# Altium schematic sheet MACH_NGUYEN_LY.SchDoc
size A4
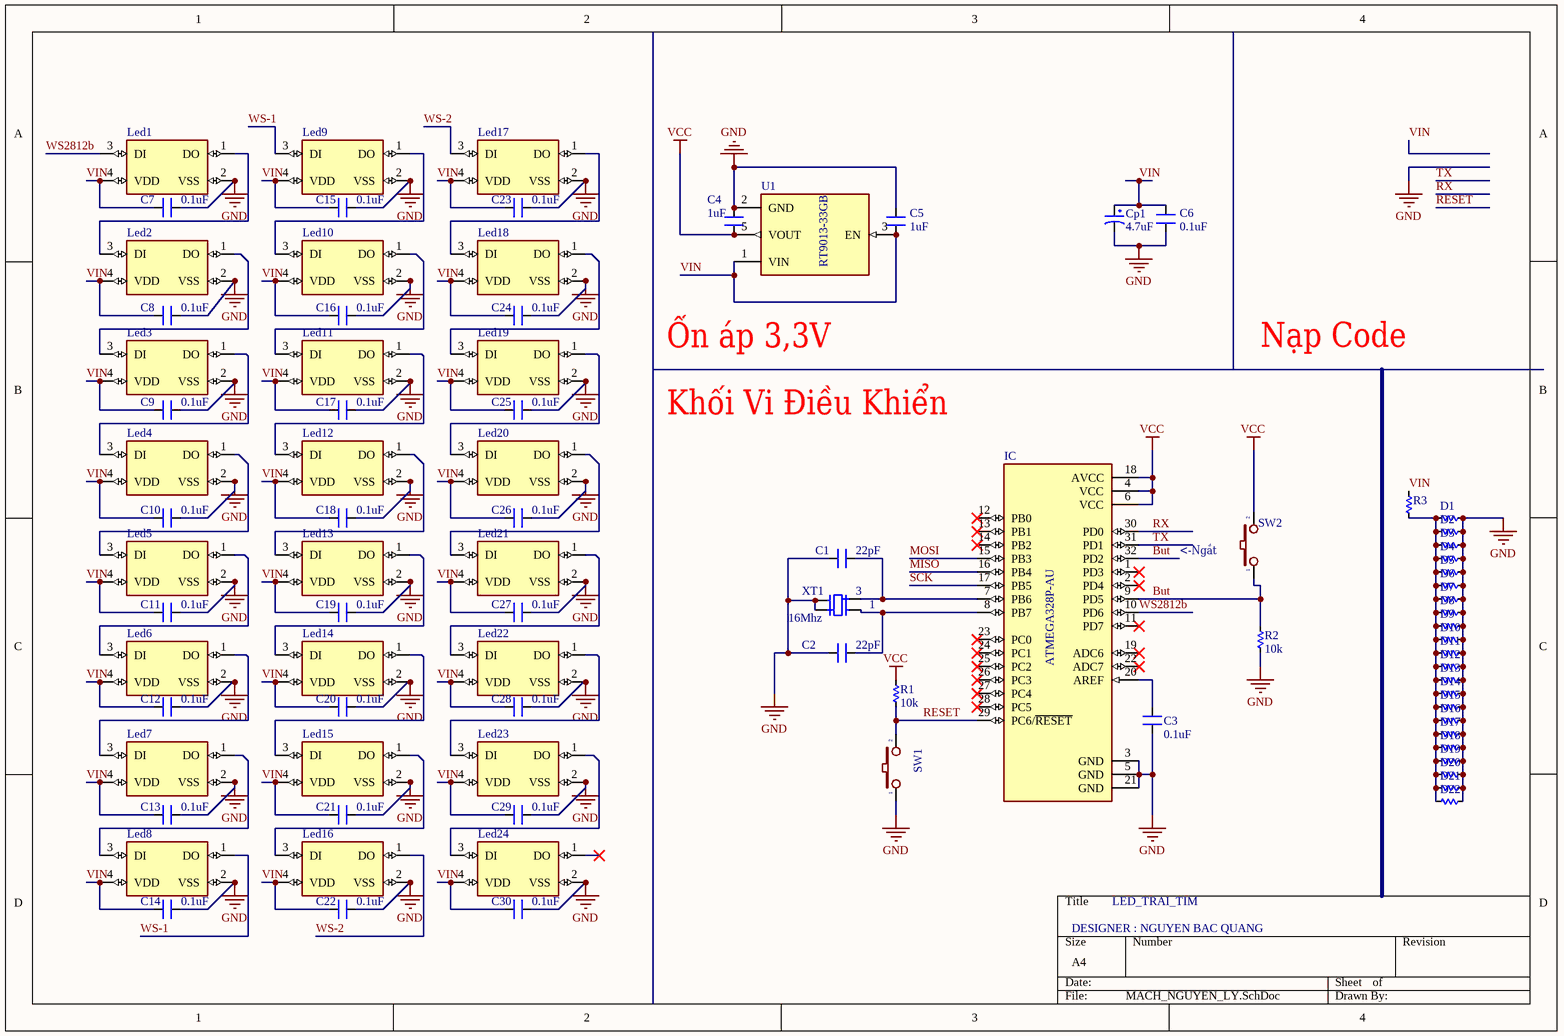
[diagram p0: MACH_NGUYEN_LY.SchDoc]

## Parts
C1  22pF  [CN-SMD-0805]
C2  22pF  [CN-SMD-0805]
C3  0.1uF  [CN-SMD-0603]
C4  1uF  [CN-SMD-0805]
C5  1uF  [CN-SMD-0805]
C6  0.1uF  [CN-SMD-0603]
C7  0.1uF  [CN-SMD-0603]
C8  0.1uF  [CN-SMD-0603]
C9  0.1uF  [CN-SMD-0603]
C10  0.1uF  [CN-SMD-0603]
C11  0.1uF  [CN-SMD-0603]
C12  0.1uF  [CN-SMD-0603]
C13  0.1uF  [CN-SMD-0603]
C14  0.1uF  [CN-SMD-0603]
C15  0.1uF  [CN-SMD-0603]
C16  0.1uF  [CN-SMD-0603]
C17  0.1uF  [CN-SMD-0603]
C18  0.1uF  [CN-SMD-0603]
C19  0.1uF  [CN-SMD-0603]
C20  0.1uF  [CN-SMD-0603]
C21  0.1uF  [CN-SMD-0603]
C22  0.1uF  [CN-SMD-0603]
C23  0.1uF  [CN-SMD-0603]
C24  0.1uF  [CN-SMD-0603]
C25  0.1uF  [CN-SMD-0603]
C26  0.1uF  [CN-SMD-0603]
C27  0.1uF  [CN-SMD-0603]
C28  0.1uF  [CN-SMD-0603]
C29  0.1uF  [CN-SMD-0603]
C30  0.1uF  [CN-SMD-0603]
Cp1  4.7uF  [tu tantalum smd3216]
D1  (no value)  [RES-SMD-0603]
D2  (no value)  [RES-SMD-0603]
D3  (no value)  [RES-SMD-0603]
D4  (no value)  [RES-SMD-0603]
D5  (no value)  [RES-SMD-0603]
D6  (no value)  [RES-SMD-0603]
D7  (no value)  [RES-SMD-0603]
D8  (no value)  [RES-SMD-0603]
D9  (no value)  [RES-SMD-0603]
D10  (no value)  [RES-SMD-0603]
D11  (no value)  [RES-SMD-0603]
D12  (no value)  [RES-SMD-0603]
D13  (no value)  [RES-SMD-0603]
D14  (no value)  [RES-SMD-0603]
D15  (no value)  [RES-SMD-0603]
D16  (no value)  [RES-SMD-0603]
D17  (no value)  [RES-SMD-0603]
D18  (no value)  [RES-SMD-0603]
D19  (no value)  [RES-SMD-0603]
D20  (no value)  [RES-SMD-0603]
D21  (no value)  [RES-SMD-0603]
D22  (no value)  [RES-SMD-0603]
IC  ATMEGA328P-AU  [QFP80P900X900X120-32N]
Led1  (no value)  [WS2812B-2020]
Led2  (no value)  [WS2812B-2020]
Led3  (no value)  [WS2812B-2020]
Led4  (no value)  [WS2812B-2020]
Led5  (no value)  [WS2812B-2020]
Led6  (no value)  [WS2812B-2020]
Led7  (no value)  [WS2812B-2020]
Led8  (no value)  [WS2812B-2020]
Led9  (no value)  [WS2812B-2020]
Led10  (no value)  [WS2812B-2020]
Led11  (no value)  [WS2812B-2020]
Led12  (no value)  [WS2812B-2020]
Led13  (no value)  [WS2812B-2020]
Led14  (no value)  [WS2812B-2020]
Led15  (no value)  [WS2812B-2020]
Led16  (no value)  [WS2812B-2020]
Led17  (no value)  [WS2812B-2020]
Led18  (no value)  [WS2812B-2020]
Led19  (no value)  [WS2812B-2020]
Led20  (no value)  [WS2812B-2020]
Led21  (no value)  [WS2812B-2020]
Led22  (no value)  [WS2812B-2020]
Led23  (no value)  [WS2812B-2020]
Led24  (no value)  [WS2812B-2020]
R1  10k  [RES-SMD-0603]
R2  10k  [RES-SMD-0603]
R3  (no value)  [RES-SMD-0603]
SW1  (no value)  [SW1-SMD]
SW2  (no value)  [SW1-SMD]
U1  RT9013-33GB  [SOT94P279X129-5N]
XT1  16Mhz  [Thach Anh 4 chan 1]

## Nets
GND: C1.1 C2.1 C3.2 C4.1 C5.2 C6.2 C7.2 C8.2 C9.2 C10.2 C11.2 C12.2 C13.2 C14.2 C15.2 C16.2 C17.2 C18.2 C19.2 C20.2 C21.2 C22.2 C23.2 C24.2 C25.2 C26.2 C27.2 C28.2 C29.2 C30.2 Cp1.2 D1.1 D2.1 D3.1 D4.1 D5.1 D6.1 D7.1 D8.1 D9.1 D10.1 D11.1 D12.1 D13.1 D14.1 D15.1 D16.1 D17.1 D18.1 D19.1 D20.1 D21.1 D22.1 IC.3(GND) IC.5(GND) IC.21(GND) Led1.2(VSS) Led2.2(VSS) Led3.2(VSS) Led4.2(VSS) Led5.2(VSS) Led6.2(VSS) Led7.2(VSS) Led8.2(VSS) Led9.2(VSS) Led10.2(VSS) Led11.2(VSS) Led12.2(VSS) Led13.2(VSS) Led14.2(VSS) Led15.2(VSS) Led16.2(VSS) Led17.2(VSS) Led18.2(VSS) Led19.2(VSS) Led20.2(VSS) Led21.2(VSS) Led22.2(VSS) Led23.2(VSS) Led24.2(VSS) R2.2 SW1.1 U1.2(GND) XT1.2 XT1.4
VCC: C4.2 IC.4(VCC) IC.6(VCC) IC.18(AVCC) R1.1 SW2.2 U1.5(VOUT)
But: IC.9(PD5) IC.32(PD2) R2.1 SW2.1
MISO: IC.16(PB4)
MOSI: IC.15(PB3)
RESET: IC.29(PC6/~{RESET}) R1.2 SW1.2
RX: IC.30(PD0)
SCK: IC.17(PB5)
TX: IC.31(PD1)
VIN: C5.1 C6.1 C7.1 C8.1 C9.1 C10.1 C11.1 C12.1 C13.1 C14.1 C15.1 C16.1 C17.1 C18.1 C19.1 C20.1 C21.1 C22.1 C23.1 C24.1 C25.1 C26.1 C27.1 C28.1 C29.1 C30.1 Cp1.1 Led1.4(VDD) Led2.4(VDD) Led3.4(VDD) Led4.4(VDD) Led5.4(VDD) Led6.4(VDD) Led7.4(VDD) Led8.4(VDD) Led9.4(VDD) Led10.4(VDD) Led11.4(VDD) Led12.4(VDD) Led13.4(VDD) Led14.4(VDD) Led15.4(VDD) Led16.4(VDD) Led17.4(VDD) Led18.4(VDD) Led19.4(VDD) Led20.4(VDD) Led21.4(VDD) Led22.4(VDD) Led23.4(VDD) Led24.4(VDD) R3.1 U1.1(VIN) U1.3(EN)
WS2812b: IC.10(PD6) Led1.3(DI)
WS-1: Led8.1(DO) Led9.3(DI)
WS-2: Led16.1(DO) Led17.3(DI)
NetC1_2: C1.2 IC.7(PB6) XT1.3
NetC2_2: C2.2 IC.8(PB7) XT1.1
NetC3_1: C3.1 IC.20(AREF)
NetD1_2: D1.2 D2.2 D3.2 D4.2 D5.2 D6.2 D7.2 D8.2 D9.2 D10.2 D11.2 D12.2 D13.2 D14.2 D15.2 D16.2 D17.2 D18.2 D19.2 D20.2 D21.2 D22.2 R3.2
NetLed1_1: Led1.1(DO) Led2.3(DI)
NetLed2_1: Led2.1(DO) Led3.3(DI)
NetLed3_1: Led3.1(DO) Led4.3(DI)
NetLed4_1: Led4.1(DO) Led5.3(DI)
NetLed5_1: Led5.1(DO) Led6.3(DI)
NetLed6_1: Led6.1(DO) Led7.3(DI)
NetLed7_1: Led7.1(DO) Led8.3(DI)
NetLed9_1: Led9.1(DO) Led10.3(DI)
NetLed10_1: Led10.1(DO) Led11.3(DI)
NetLed11_1: Led11.1(DO) Led12.3(DI)
NetLed12_1: Led12.1(DO) Led13.3(DI)
NetLed13_1: Led13.1(DO) Led14.3(DI)
NetLed14_1: Led14.1(DO) Led15.3(DI)
NetLed15_1: Led15.1(DO) Led16.3(DI)
NetLed17_1: Led17.1(DO) Led18.3(DI)
NetLed18_1: Led18.1(DO) Led19.3(DI)
NetLed19_1: Led19.1(DO) Led20.3(DI)
NetLed20_1: Led20.1(DO) Led21.3(DI)
NetLed21_1: Led21.1(DO) Led22.3(DI)
NetLed22_1: Led22.1(DO) Led23.3(DI)
NetLed23_1: Led23.1(DO) Led24.3(DI)

Not connected (* = marked no-connect by the designer): IC 1(PD3)* 2(PD4)* 11(PD7)* 12(PB0)* 13(PB1)* 14(PB2)* 19(ADC6)* 22(ADC7)* 23(PC0)* 24(PC1)* 25(PC2)* 26(PC3)* 27(PC4)* 28(PC5)*; Led24 1(DO)*

## Notes on the sheet
- Ổn áp 3,3V
- Nạp Code
- Khối Vi Điều Khiển
- (near SW2) <-Ngắt
- (near XT1) 3
- (near XT1) 1
- LED_TRAI_TIM
- DESIGNER : NGUYEN BAC QUANG

## Library data of the parts
C1-C30 = CN: Value: 33pF
Cp1 = Tu tantalum 4.7uF 16V SMD3216: Dán; Don_Vi: Con; So_Chan: 2; Ten_Linh_Kien: Tụ tantalum 475C-4.7uF 16V SMD3216; Ma_Hang: MH008686; Chung_Loai: Dán; Kieu_Chan: *
D1-D22 R1-R3 = Res-SMD: Resistor; Manufacturer: Generic Components; Class: Passive; Published: 08/06/2000; Publisher: Altium Hobart Technology Centre
IC = ATMEGA328P-AU: AVR AVRÂ® ATmega Microcontroller IC 8-Bit 20MHz 32KB (16K x 16) FLASH 32-TQFP (7x7); MF: Microchip Technology; SnapEDA_Link: https://www.snapeda.com/parts/ATMEGA328P-AU/Microchip/view-part/?ref=snap; Package: TQFP-32 Microchip; Value: *; MP: ATMEGA328P-AU; Check_prices: https://www.snapeda.com/parts/ATMEGA328P-AU/Microchip/view-part/?ref=eda
Led1-Led24 = WS2812B-2020: Programmable LED; SMD; 2020; RGB; 2x2x0.84mm; 3.7Ã·5.3V; 2kHz; MF: WorldSemi; SnapEDA_Link: https://www.snapeda.com/parts/WS2812B-2020/Worldsemi/view-part/?ref=snap; Package: None; Value: *; MP: WS2812B-2020; Check_prices: https://www.snapeda.com/parts/WS2812B-2020/Worldsemi/view-part/?ref=eda
SW1 SW2 = SW2: Switch button 2 pin; Value: SW chip 2 pin
U1 = RT9013-33GB: Linear Voltage Regulator IC 1 Output 500mA SOT-23-5; MF: Richtek USA; Availability: Unavailable; Price: None; SnapEDA_Link: https://www.snapeda.com/parts/RT9013-33GB/Richtek%20USA%20Inc./view-part/553199/?ref=snap; Value: *; MP: RT9013-33GB; Package: SOT-23-5 Richtek
XT1 = Thach Anh 4 Chan SMD: Crystal For all Crystal 2pin.; Value: 4Mhz